# EAGLE design Teensy-Maxuino-Slave-DRV4835 4x shield (EAGLE 6.4)
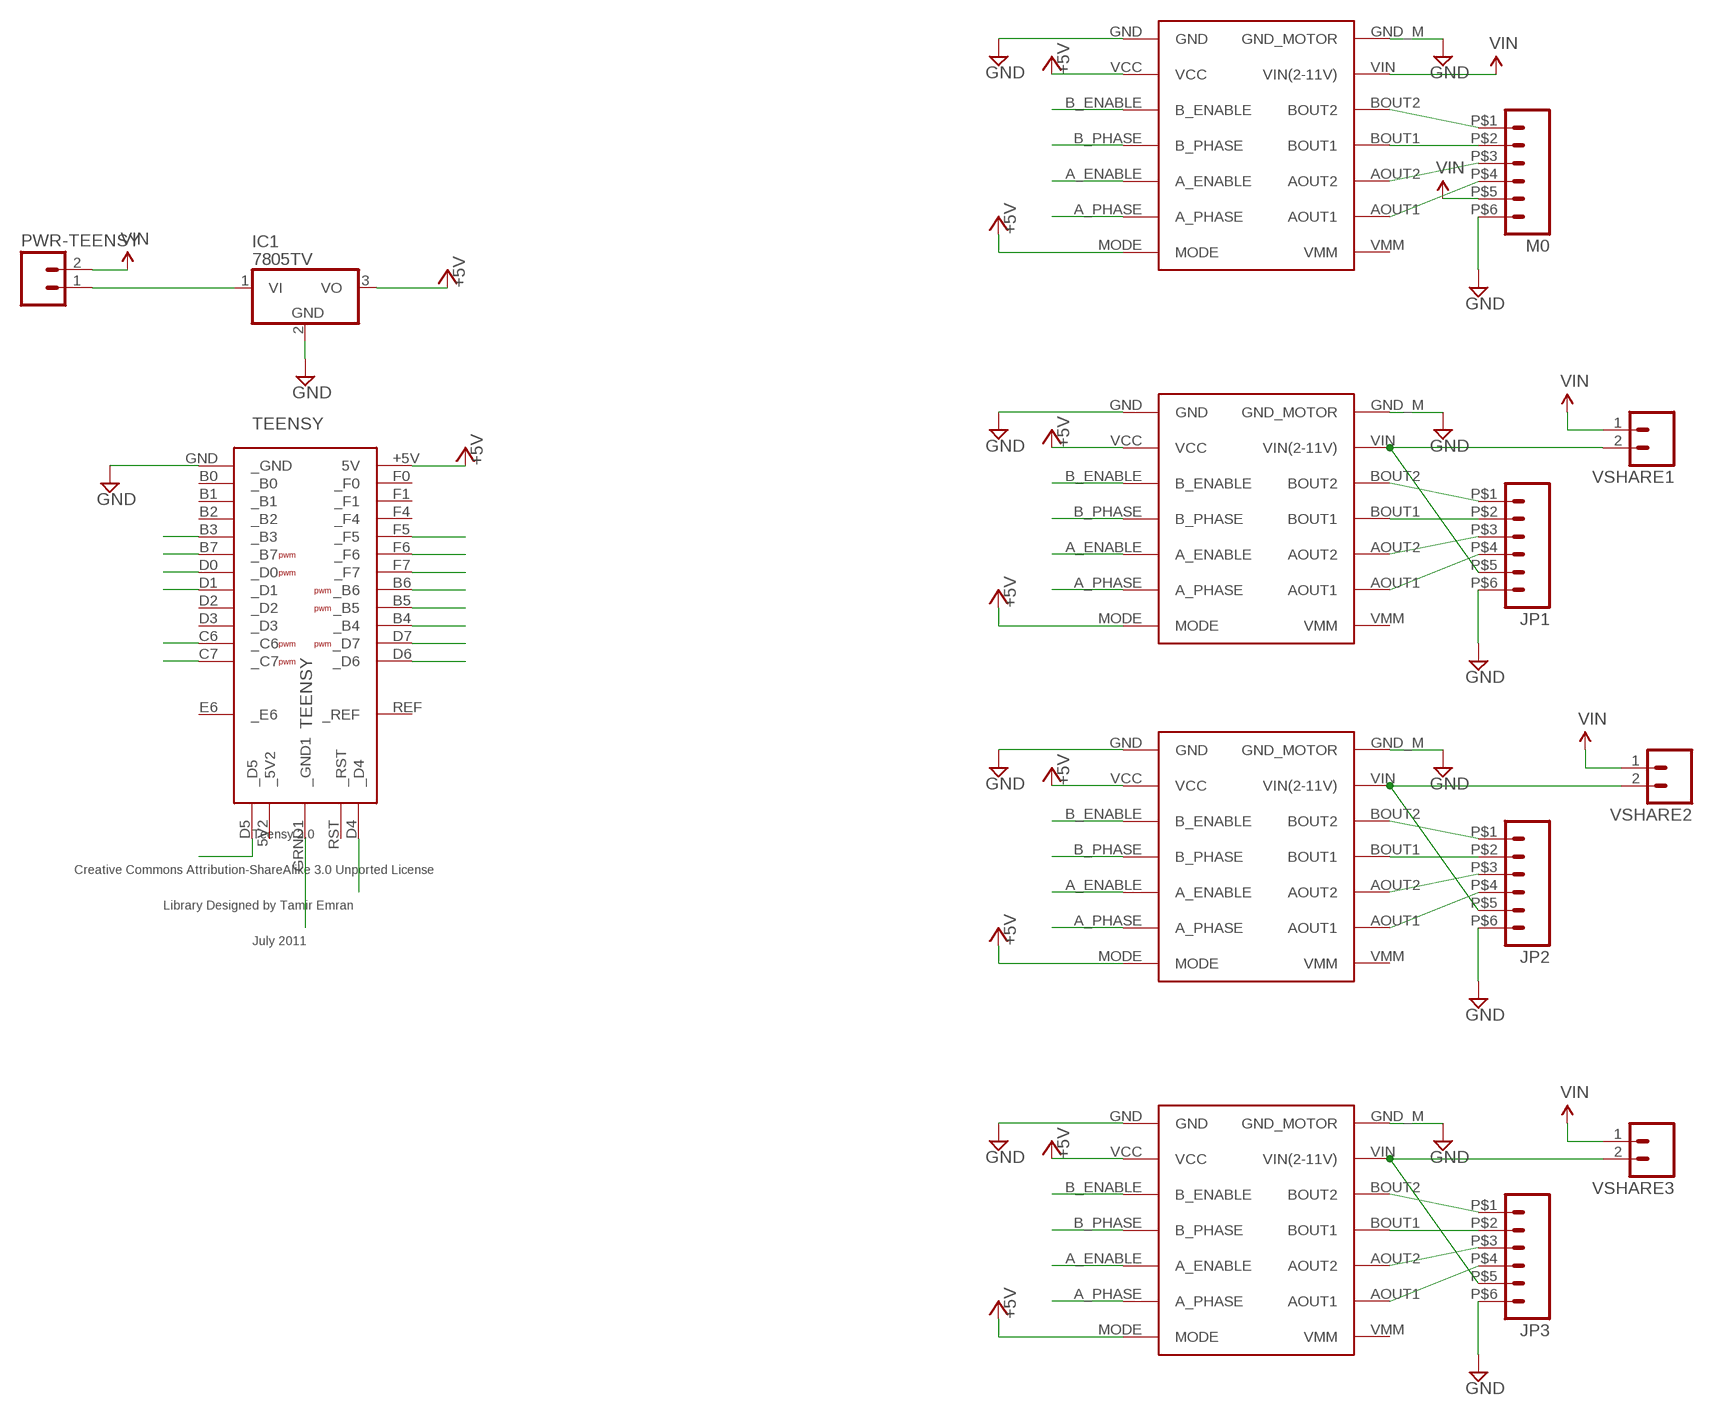
[diagram p0: schematic, sheet 1]

## Parts
DRV0  POLOLU_DRV8835  [POLOLU_DRV8835]
DRV1  POLOLU_DRV8835  [POLOLU_DRV8835]
DRV2  POLOLU_DRV8835  [POLOLU_DRV8835]
DRV3  POLOLU_DRV8835  [POLOLU_DRV8835]
IC1  7805TV  [TO220V]
JP1  M06  [SPRINGTERMINAL-2.54MM-6]
JP2  M06  [SPRINGTERMINAL-2.54MM-6]
JP3  M06  [SPRINGTERMINAL-2.54MM-6]
M0  M06  [SPRINGTERMINAL-2.54MM-6]
PWR-TEENSY  M02PTH  [1X02]
TEENSY  TEENSY  [TEENSY]
VSHARE1  M02PTH  [1X02]
VSHARE2  M02PTH  [1X02]
VSHARE3  M02PTH  [1X02]

## Nets
+5V [Power]: DRV0.MODE DRV0.VCC DRV1.MODE DRV1.VCC DRV2.MODE DRV2.VCC DRV3.MODE DRV3.VCC IC1.3(VO) TEENSY.+5V(5V)
A_ENABLE: DRV0.A_ENABLE
A_ENABLE0: TEENSY.D7(_D7)
A_ENABLE1: DRV1.A_ENABLE TEENSY.C6(_C6)
A_ENABLE2: DRV2.A_ENABLE TEENSY.D0(_D0)
A_ENABLE3: DRV3.A_ENABLE TEENSY.B5(_B5)
A_PHASE: DRV0.A_PHASE
A_PHASE1: DRV1.A_PHASE TEENSY.D5(_D5)
A_PHASE2: DRV2.A_PHASE TEENSY.D1(_D1)
A_PHASE3: DRV3.A_PHASE TEENSY.F5(_F5)
ATTRU [GND]: JP1.P$6 JP2.P$6 JP3.P$6 M0.P$6 ; supply symbol labelled GND
B_ENABLE: DRV0.B_ENABLE TEENSY.B4(_B4)
B_ENABLE1: DRV1.B_ENABLE TEENSY.C7(_C7)
B_ENABLE2: DRV2.B_ENABLE TEENSY.B7(_B7)
B_ENABLE3: DRV3.B_ENABLE TEENSY.B6(_B6)
B_PHASE: DRV0.B_PHASE TEENSY.D6(_D6) TEENSY.F7(_F7)
B_PHASE1: DRV1.B_PHASE TEENSY.D4(_D4)
B_PHASE2: DRV2.B_PHASE TEENSY.B3(_B3)
B_PHASE3: DRV3.B_PHASE TEENSY.F6(_F6)
GND [GND]: DRV0.GND DRV0.GND_M(GND_MOTOR) DRV1.GND DRV1.GND_M(GND_MOTOR) DRV2.GND DRV2.GND_M(GND_MOTOR) DRV3.GND DRV3.GND_M(GND_MOTOR) IC1.2(GND) TEENSY.GND(_GND) TEENSY.GRND1(_GND1)
N$1 [Power]: DRV0.AOUT1 M0.P$4
N$2 [Power]: DRV0.AOUT2 M0.P$3
N$3 [Power]: DRV0.BOUT1 M0.P$2
N$4 [Power]: DRV0.BOUT2 M0.P$1
N$5 [Power]: DRV1.AOUT1 JP1.P$4
N$6 [Power]: DRV1.AOUT2 JP1.P$3
N$7 [Power]: DRV1.BOUT1 JP1.P$2
N$8 [Power]: DRV1.BOUT2 JP1.P$1
N$9 [Power]: DRV2.AOUT1 JP2.P$4
N$10 [Power]: DRV2.AOUT2 JP2.P$3
N$11 [Power]: DRV2.BOUT1 JP2.P$2
N$12 [Power]: DRV2.BOUT2 JP2.P$1
N$13 [Power]: DRV3.AOUT1 JP3.P$4
N$14 [Power]: DRV3.AOUT2 JP3.P$3
N$15 [Power]: DRV3.BOUT1 JP3.P$2
N$16 [Power]: DRV3.BOUT2 JP3.P$1
N$17 [Power]: IC1.1(VI) PWR-TEENSY.1
VIN [Power]: DRV0.VIN(VIN(2-11V)) M0.P$5 PWR-TEENSY.2 VSHARE1.1 VSHARE2.1 VSHARE3.1
VIN1 [Power]: DRV1.VIN(VIN(2-11V)) JP1.P$5 VSHARE1.2
VIN2 [Power]: DRV2.VIN(VIN(2-11V)) JP2.P$5 VSHARE2.2
VIN3 [Power]: DRV3.VIN(VIN(2-11V)) JP3.P$5 VSHARE3.2
Unconnected: DRV0.VMM DRV1.VMM DRV2.VMM DRV3.VMM TEENSY.5V2(_5V2) TEENSY.B0(_B0) TEENSY.B1(_B1) TEENSY.B2(_B2) TEENSY.D2(_D2) TEENSY.D3(_D3) TEENSY.E6(_E6) TEENSY.F0(_F0) TEENSY.F1(_F1) TEENSY.F4(_F4) TEENSY.REF(_REF) TEENSY.RST(_RST)

## Library data of the parts
DRV0 DRV1-DRV3 = aliEagleLib:POLOLU_DRV8835
IC1 = linear:78*: Positive VOLTAGE REGULATOR Source: http://cache.national.com/ds/LM/LM78L05.pdf http://www.fairchildsemi.com/ds/LM/LM7805.pdf
JP1-JP3 M0 = aliEagleLib:M06: Header 6 Standard 6-pin 0.1" header. Use with straight break away headers (SKU : PRT-00116), right angle break away headers (PRT-00553), swiss pins (PRT-00743), machine pins (PRT-00117), and female headers (PRT-00115). Molex polarized connector foot print use with SKU : PRT-08094 with associated crimp pins and housings. NOTES ON THE VARIANTS LOCK and LOCK_LONGPADS... This footprint was designed to help hold the alignment of a through-hole component (i.e. 6-pin header) while soldering it into place. You may notice that each hole has been shifted either up or down by 0.005 of an inch from it's more standard position (which is a perfectly straight line). This slight alteration caused the pins (the squares in the middle) to touch the edges of the holes. Because they are alternating, it causes a "brace" to hold the component in place. 0.005 has proven to be the perfect amount of "off-center" position when using our standard breakaway headers. Although looks a little odd when you look at the bare footprint, once you have a header in there, the alteration is very hard to notice. Also, if you push a header all the way into place, it is covered up entirely on the bottom side. This idea of altering the position of holes to aid alignment will be further integrated into the Sparkfun Library for other footprints. It can help hold any component with 3 or more connection pins.
PWR-TEENSY VSHARE1-VSHARE3 = aliEagleLib:M02: Header 2 Standard 2-pin 0.1" header. Use with straight break away headers (SKU : PRT-00116), right angle break away headers (PRT-00553), swiss pins (PRT-00743), machine pins (PRT-00117), and female headers (PRT-00115). Molex polarized connector foot print use with SKU : PRT-08233 with associated crimp pins and housings.
TEENSY = aliEagleLib:TEENSY: Teensy 2.0 Original Design by Clint Fisher Modified Design by Tamir Emran Licensed Under Creative Commons Attribution-ShareAlike 3.0 Unported (CC BY-SA 3.0)

## Net classes
0 default: width 0.152 mm, clearance 0.152 mm
1 GND: width 0.508 mm, clearance 0.152 mm
2 Power: width 0.508 mm, clearance 0.152 mm

## Board
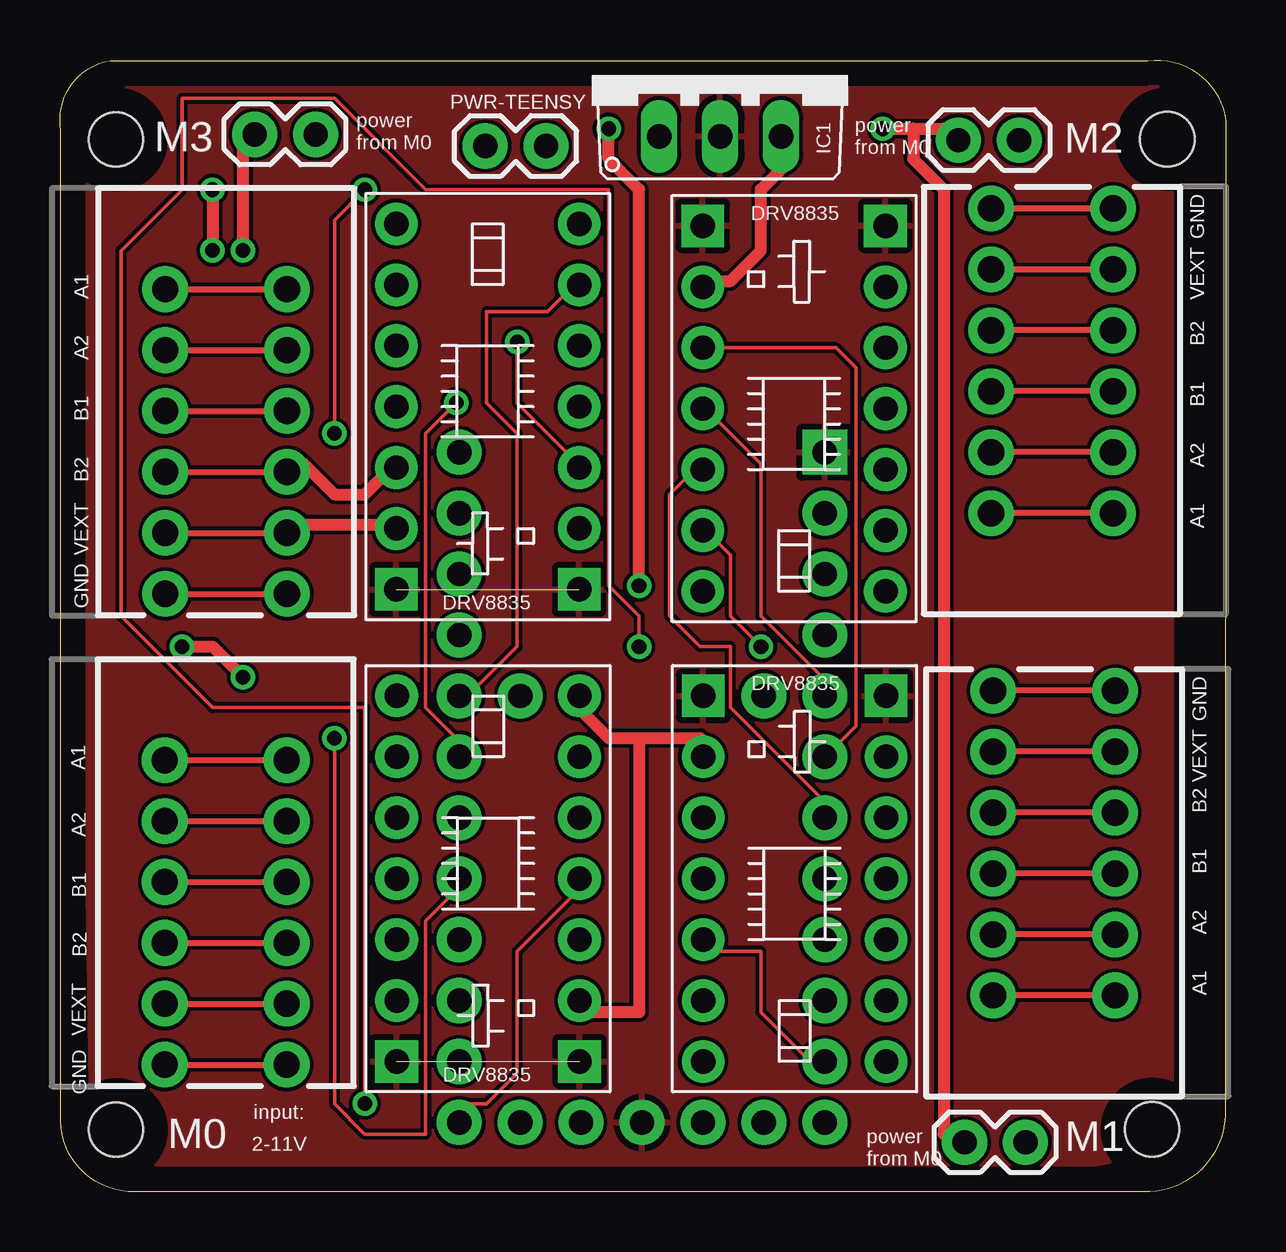
[diagram p1: board, top side]
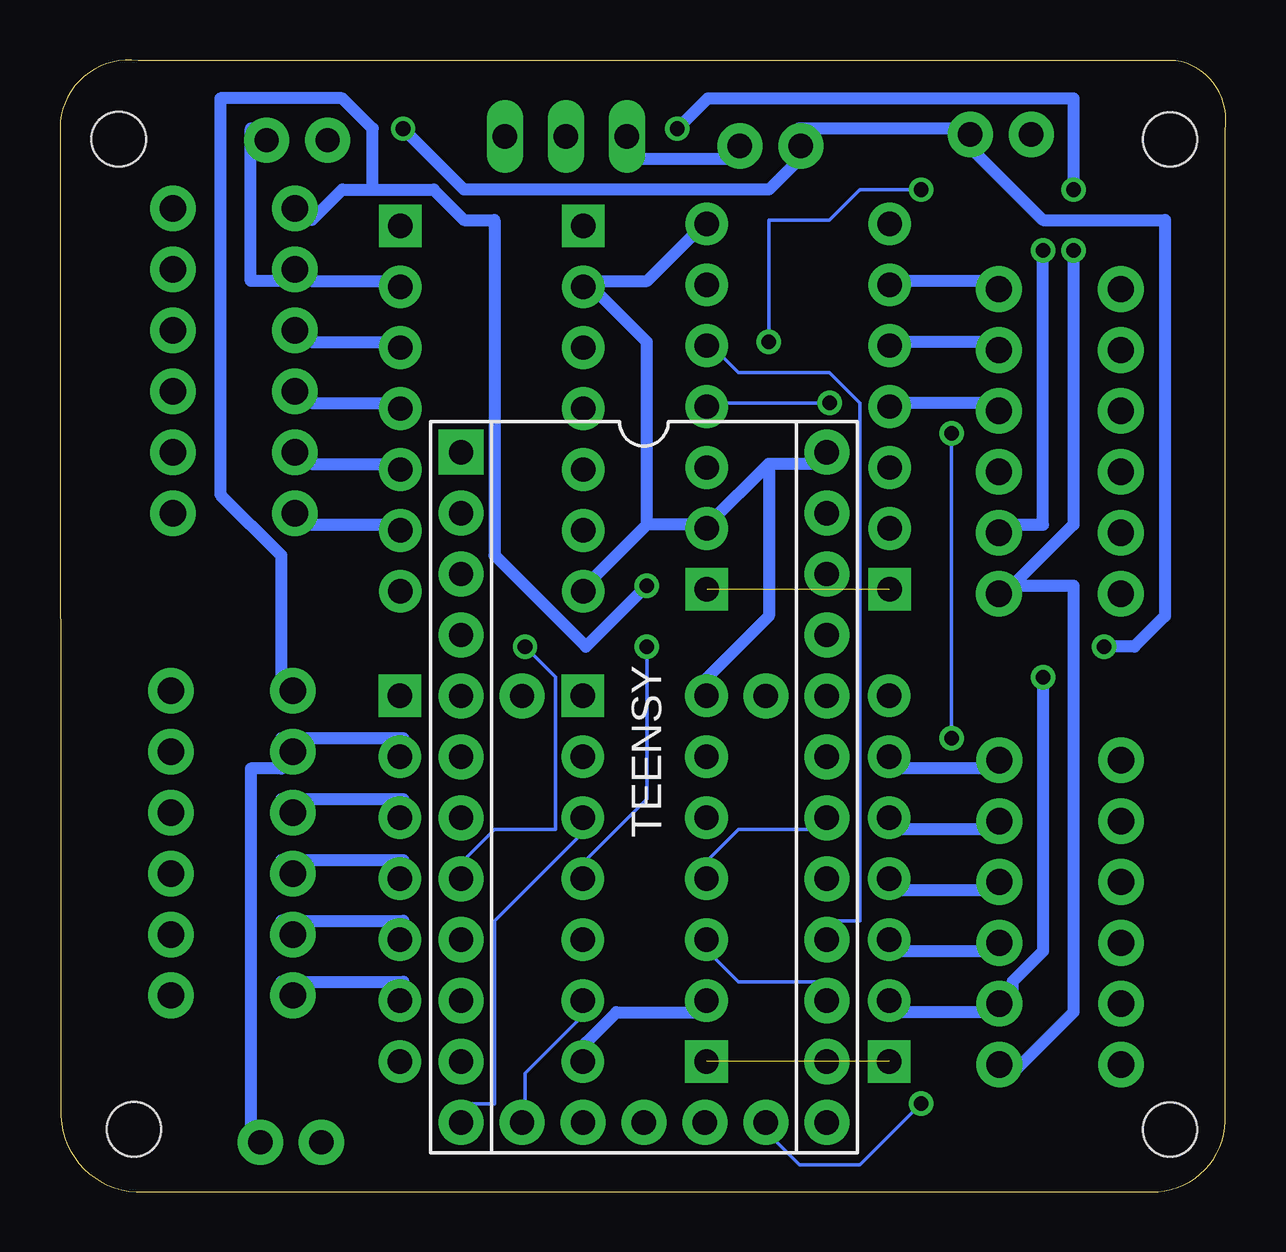
[diagram p2: board, bottom side, seen from below]

Size 48.6 x 47.18 mm. Coordinates in mm from the lower left corner, seen from the top.
Outline: 48.57,3.15 arc-90 45.12,0 2.83,0.01 arc-90 0.04,3.22 0.04,44.25 arc-90 2.09,47.16 45.34,47.16 arc-90 48.6,44.63 48.57,3.15
Copper layers (1*16): Top 0.035mm / dielectric 1.5mm / Bottom 0.035mm
Design rules "default *": minimum track width 6mil, minimum drill 24mil, track to track 6mil, track to pad 6mil, pad to pad 6mil, via to via 6mil, smd to smd 6mil, copper to edge 40mil, drill to drill 6mil, minimum pad ring 10mil, minimum via ring 8mil, stop-mask expansion 4mil, vias tented up to drill 0mil, thermal gap 10mil
Holes 2.26 mm at 46.16,43.87 2.34,2.59 2.33,43.86 45.52,2.6

### Footprints (pad centres in the part's own frame; a part is rotated, then mirrored left to right if it is on the bottom)
POLOLU_DRV8835 = drill 1.016 pad 1.778: A_ENABLE -3.81,-3.81; A_PHASE -3.81,-6.35; AOUT1 3.81,-6.35; AOUT2 3.81,-3.81; B_ENABLE -3.81,1.27; B_PHASE -3.81,-1.27; BOUT1 3.81,-1.27; BOUT2 3.81,1.27; MODE -3.81,-8.89; VCC -3.81,3.81; VIN 3.81,3.81; VMM 3.81,-8.89 | drill 1.016 pad 1.778 square: GND -3.81,6.35; GND_M 3.81,6.35
TO220V = drill 1.016 long: 1 -2.54,-2.54; 2 0,-2.54; 3 2.54,-2.54
SPRINGTERMINAL-2.54MM-6 = drill 1.1 pad 1.9: 1 2.54,-2.54; 2 0,-2.54; 3 -2.54,-2.54; 4 -5.08,-2.54; 5 5.08,-2.54; 6 7.62,-2.54; P$1 2.54,2.54; P$2 0,2.54; P$3 -2.54,2.54; P$4 -5.08,2.54; P$5 5.08,2.54; P$6 7.62,2.54
1X02 = drill 1.016 pad 1.88: 1 0,0; 2 2.54,0
TEENSY = drill 1.016 pad 1.88: 5V2 13.97,-2.54; +5V -13.97,7.62; B0 -11.43,-7.62; B1 -8.89,-7.62; B2 -6.35,-7.62; B3 -3.81,-7.62; B4 8.89,7.62; B5 6.35,7.62; B6 3.81,7.62; B7 -1.27,-7.62; C6 11.43,-7.62; C7 13.97,-7.62; D0 1.27,-7.62; D1 3.81,-7.62; D2 6.35,-7.62; D3 8.89,-7.62; D4 13.97,5.08; D5 13.97,-5.08; D6 13.97,7.62; D7 11.43,7.62; E6 -3.81,-5.08; F0 -11.43,7.62; F1 -8.89,7.62; F4 -6.35,7.62; F5 -3.81,7.62; F6 -1.27,7.62; F7 1.27,7.62; GRND1 13.97,0; REF -3.81,5.08; RST 13.97,2.54 | drill 1.016 pad 1.88 square: GND -13.97,-7.62

### Placement (x,y rotation side)
DRV0  17.84,11.78 180 top
DRV1  30.62,14.32 0 top
DRV2  30.6,33.92 0 top
DRV3  17.83,31.46 180 top
IC1  27.51,46.54 0 top
JP1  41.44,13.27 90 top
JP2  41.35,33.37 90 top
JP3  6.92,32.54 270 top
M0  6.91,12.92 270 top
PWR-TEENSY  20.26,43.59 180 top
TEENSY  24.26,16.86 270 bottom
VSHARE1  37.71,2.06 0 top
VSHARE2  37.45,43.84 0 top
VSHARE3  10.66,44.08 180 top

### Tracks (layer width: path | path; a pad name or v marks a point on that pad's centre or on a via)
+5V
  Top 0.508: IC1.3 30.49,43.04 29.22,41.77 29.22,39.23 27.95,37.96 26.68,37.96 DRV2.VCC | 24.14,18.91 22.87,18.91 21.6,20.18 DRV0.MODE | 24.14,18.91 26.68,18.91 DRV1.VCC | 24.14,18.91 24.14,7.48 21.6,7.48 DRV0.VCC
  Bottom 0.508: 26.68,37.96 24.14,37.96 21.6,40.5 DRV3.MODE | DRV0.VCC 21.6,7.48 25.41,7.48 26.68,6.21 DRV1.MODE | 19.06,30.34 21.6,27.8 | 19.06,30.34 16.52,30.34 TEENSY.+5V | 19.06,30.34 19.06,23.99 21.6,21.45 DRV0.MODE | 24.14,27.8 26.68,25.26 DRV2.MODE | 21.6,27.8 24.14,27.8 | 21.6,27.8 DRV3.VCC | 26.68,37.96 24.14,35.42 24.14,27.8 | 26.68,37.96 DRV2.VCC
A_ENABLE1
  Top 0.152: DRV1.A_ENABLE 26.68,10.02 29.22,10.02 29.22,7.48 31.76,4.94 TEENSY.C6
A_ENABLE2
  Top 0.152: DRV2.A_ENABLE 26.68,30.34 25.41,29.07 25.41,23.99 26.68,22.72 27.95,22.72 27.95,20.18 31.76,16.37 TEENSY.D0
A_ENABLE3
  Bottom 0.152: DRV3.A_ENABLE 21.6,35.42 20.33,34.15 16.52,34.15 15.25,32.88 15.25,11.29 16.52,11.29 TEENSY.B5
A_PHASE1
  Bottom 0.152: DRV1.A_PHASE 26.68,7.48 29.22,4.94 29.22,3.67 TEENSY.D5
A_PHASE2  (via drill 0.61)
  Top 0.152: v29.22,22.72 27.95,23.99 27.95,26.53 26.68,27.8 DRV2.A_PHASE
  Bottom 0.152: v29.22,22.72 27.95,21.45 27.95,15.1 30.49,15.1 31.76,13.83 TEENSY.D1
A_PHASE3
  Top 0.152: DRV3.A_PHASE 21.6,37.96 20.33,36.69 17.79,36.69 17.79,32.88 19.06,31.61 19.06,22.72 16.52,20.18 TEENSY.F5
ATTRU  (via drill 0.61)
  Top 0.508: v6.36,41.77 v6.36,39.23 | v22.87,44.31 22.87,43.04 24.14,41.77 v24.14,25.26
  Bottom 0.508: 8.9,25.26 6.36,25.26 6.36,7.48 8.9,4.94 M0.P$6 | 35.57,41.77 35.57,44.31 36.84,45.58 41.92,45.58 41.92,29.07 39.38,26.53 39.38,21.45 JP1.P$6 | 35.57,41.77 36.84,41.77 38.11,40.5 JP2.P$6 | 8.9,25.26 6.36,27.8 v6.36,39.23 | v6.36,41.77 6.36,45.58 21.6,45.58 v22.87,44.31 | v24.14,25.26 26.68,22.72 30.49,26.53 30.49,40.5 31.76,40.5 33.03,41.77 35.57,41.77 | 8.9,25.26 JP3.P$6
B_ENABLE
  Bottom 0.152: DRV0.B_ENABLE 21.6,10.02 20.33,8.75 16.52,8.75 TEENSY.B4
B_ENABLE1
  Bottom 0.152: DRV1.B_ENABLE 26.68,15.1 30.49,11.29 30.49,3.67 31.76,3.67 TEENSY.C7
B_ENABLE2
  Top 0.152: TEENSY.B7 33.17,19.42 33.17,34.35 32.33,35.19 DRV2.B_ENABLE
B_ENABLE3  (via drill 0.61)
  Top 0.152: v19.06,35.42 19.06,32.88 21.6,30.34 DRV3.B_ENABLE | v12.71,41.77 11.44,40.5 v11.44,31.61 | v11.44,18.91 11.44,3.67 12.71,2.4 15.25,2.4 15.25,11.29 16.52,12.56 TEENSY.B6
  Bottom 0.152: v19.06,35.42 19.06,40.5 16.52,40.5 15.25,41.77 v12.71,41.77 | v11.44,18.91 v11.44,31.61
B_PHASE
  Top 0.152: TEENSY.D6 16.52,3.67 17.79,3.67 19.06,4.94 19.06,10.02 21.6,12.56 DRV0.B_PHASE
  Bottom 0.152: DRV0.B_PHASE 21.6,13.83 20.33,15.1 16.52,15.1 TEENSY.F7
B_PHASE1  (via drill 0.61)
  Top 0.152: v24.14,22.72 24.14,23.99 22.87,25.26 22.87,41.77 15.25,41.77 11.44,45.58 5.09,45.58 5.09,41.77 2.55,39.23 2.55,23.99 6.36,20.18 12.71,20.18 v12.71,3.67
  Bottom 0.152: v24.14,22.72 24.14,16.37 26.68,13.83 DRV1.B_PHASE | v12.71,3.67 15.25,1.13 17.79,1.13 19.06,2.4 TEENSY.D4
B_PHASE2
  Top 0.152: DRV2.B_PHASE 26.68,32.88 29.22,30.34 29.22,23.99 31.76,21.45 TEENSY.B3
B_PHASE3  (via drill 0.61)
  Top 0.152: v16.52,32.88 15.25,31.61 15.25,20.18 16.52,18.91 TEENSY.F6
  Bottom 0.152: v16.52,32.88 21.6,32.88 DRV3.B_PHASE
GND  (2 unrouted)
  pour Top: 0.64,44.69 1.28,3.04 arc90 3.18,1.13 42.55,1.13 arc90 46.36,4.31 46.36,44.69 arc90 44.46,46.6 2.55,46.6 arc90
N$1
  Bottom 0.508: DRV0.AOUT1 13.98,17.64 10.17,17.64 M0.P$4
N$2
  Bottom 0.508: DRV0.AOUT2 13.98,15.1 10.17,15.1 M0.P$3
N$3
  Bottom 0.508: DRV0.BOUT1 13.98,12.56 10.17,12.56 M0.P$2
N$4
  Bottom 0.508: DRV0.BOUT2 13.98,10.02 10.17,10.02 M0.P$1
N$5
  Bottom 0.508: DRV1.AOUT1 34.3,8.75 39.38,8.75 JP1.P$4
N$6
  Bottom 0.508: DRV1.AOUT2 34.3,11.29 39.38,11.29 JP1.P$3
N$7
  Bottom 0.508: DRV1.BOUT1 34.3,13.83 39.38,13.83 JP1.P$2
N$8
  Bottom 0.508: DRV1.BOUT2 34.3,16.37 39.38,16.37 JP1.P$1
N$9
  Bottom 0.508: DRV2.AOUT1 34.3,27.8 38.11,27.8 JP2.P$4
N$10
  Bottom 0.508: DRV2.AOUT2 34.3,30.34 38.11,30.34 JP2.P$3
N$11
  Bottom 0.508: DRV2.BOUT1 34.3,32.88 38.11,32.88 JP2.P$2
N$12
  Bottom 0.508: DRV2.BOUT2 34.3,35.42 38.11,35.42 JP2.P$1
N$13
  Bottom 0.508: DRV3.AOUT1 13.98,37.96 10.17,37.96 JP3.P$4
N$14
  Bottom 0.508: DRV3.AOUT2 13.98,35.42 10.17,35.42 JP3.P$3
N$15
  Bottom 0.508: DRV3.BOUT1 13.98,32.88 10.17,32.88 JP3.P$2
N$16
  Top 0.508: DRV3.BOUT2 13.98,30.34 12.71,29.07 11.44,29.07 10.17,30.34 JP3.P$1
N$17
  Bottom 0.508: IC1.1 25.41,43.04 20.33,43.04 PWR-TEENSY.1
VIN  (via drill 0.61)
  Top 0.508: v34.3,44.31 35.57,44.31 | 35.57,44.31 36.84,44.31 VSHARE2.1 | 35.57,44.31 35.57,43.04 36.84,41.77 36.84,2.4 VSHARE1.1 | v7.63,21.45 6.36,22.72 v5.09,22.72
  Bottom 0.508: DRV0.VIN 13.98,7.48 10.17,7.48 M0.P$5 8.9,7.48 8.9,8.75 7.63,10.02 v7.63,21.45 | 11.44,44.31 17.79,44.31 PWR-TEENSY.2 17.79,43.04 19.06,41.77 31.76,41.77 v34.3,44.31 | v5.09,22.72 3.82,22.72 2.55,23.99 2.55,40.5 7.63,40.5 11.44,44.31 | 11.44,44.31 VSHARE3.1
VIN1
  Bottom 0.508: DRV1.VIN 34.3,18.91 39.38,18.91 JP1.P$5 39.38,17.64 40.65,17.64 40.65,2.4 VSHARE1.2
VIN2
  Bottom 0.508: DRV2.VIN 34.3,37.96 38.11,37.96 JP2.P$5 39.38,37.96 40.65,37.96 40.65,44.31 VSHARE2.2
VIN3  (via drill 0.61)
  Top 0.508: DRV3.VIN 13.98,27.8 10.17,27.8 JP3.P$5 | v7.63,39.23 7.63,44.31 VSHARE3.2
  Bottom 0.508: v7.63,39.23 7.63,27.8 8.9,27.8 JP3.P$5

### Text on the board
tNames: power / from M0 | power / from M0 | power / from M0